# Altium project Hydrated_Buffs.PrjPcb
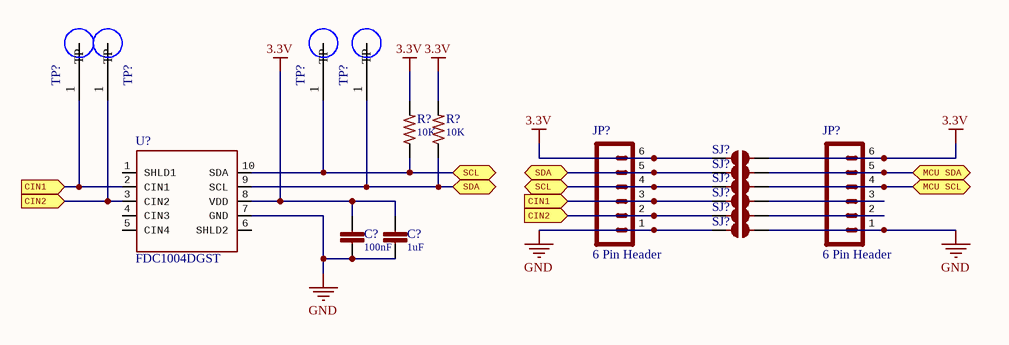
[diagram p0: FDC1004DGST.SchDoc]
3 sheets, 35 parts. Net scope: flat (ports and power ports of the same name join across sheets).
Sheets:
  FDC1004DGST.SchDoc
  Hydrated_Buffs.SchDoc
  Si7021.SchDoc

## Sheet FDC1004DGST.SchDoc
size A

### Parts
(Parts that share a designator on the sheet are numbered #1, #2 ... from top to bottom, then left to right.)
C?#1  value 100nF  (hidden comment: Cap100nF)
C?#2  value 1uF  (hidden comment: Cap1uF)
JP?#1  6 Pin Header
JP?#2  6 Pin Header
R?#1  value 10K  (hidden comment: Res10K)
R?#2  value 10K  (hidden comment: Res10K)
SJ?#1  Solder Jumper  (value not drawn)
SJ?#2  Solder Jumper  (value not drawn)
SJ?#3  Solder Jumper  (value not drawn)
SJ?#4  Solder Jumper  (value not drawn)
SJ?#5  Solder Jumper  (value not drawn)
SJ?#6  Solder Jumper  (value not drawn)
TP?#1  5019  [*TP380X203]  (value not drawn)
TP?#2  5019  [*TP380X203]  (value not drawn)
TP?#3  5019  [*TP380X203]  (value not drawn)
TP?#4  5019  [*TP380X203]  (value not drawn)
U?  FDC1004DGST  [FDC1004DGST]

### Ports
CIN1 (in), CIN2 (in), MCU SCL, MCU SDA, SCL, SDA

### Nets
3.3V: C?#1.1 C?#2.1 JP?#1.4 JP?#1.5 JP?#1.6 JP?#2.6 R?#1.1 R?#1.2 R?#2.1 R?#2.2 SJ?#1.1 SJ?#1.2 SJ?#2.1 SJ?#3.1 TP?#3.1(TP) TP?#4.1(TP) U?.8(VDD) U?.9(SCL) U?.10(SDA) ; port SCL, port SDA
GND: C?#1.2 C?#2.2 JP?#1.1 JP?#2.1 SJ?#6.1 SJ?#6.2 U?.7(GND)
NetJP?#1_2: JP?#1.2 SJ?#5.1 TP?#2.1(TP) U?.3(CIN2) ; port CIN2
NetJP?#1_3: JP?#1.3 SJ?#4.1 TP?#1.1(TP) U?.2(CIN1) ; port CIN1
NetJP?#2_2: JP?#2.2 SJ?#5.2
NetJP?#2_3: JP?#2.3 SJ?#4.2
NetJP?#2_4: JP?#2.4 SJ?#3.2 ; port MCU SCL
NetJP?#2_5: JP?#2.5 SJ?#2.2 ; port MCU SDA

Not connected (* = marked no-connect by the designer): U? 1(SHLD1) 4(CIN3) 5(CIN4) 6(SHLD2)

### Library data of the parts
TP?#1-TP?#4 = 5019: Phosphor Bronze Contact Miniature Silver Plated Surface Mount Test Points; MF: Keystone Electronics; Package: 2010 Keystone; Price: None; Availability: Unavailable; MP: 5019; SnapEDA_Link: https://www.snapeda.com/parts/5019/Keystone%20Electronics/view-part/?ref=snap; Value: *

## Sheet Hydrated_Buffs.SchDoc
size A
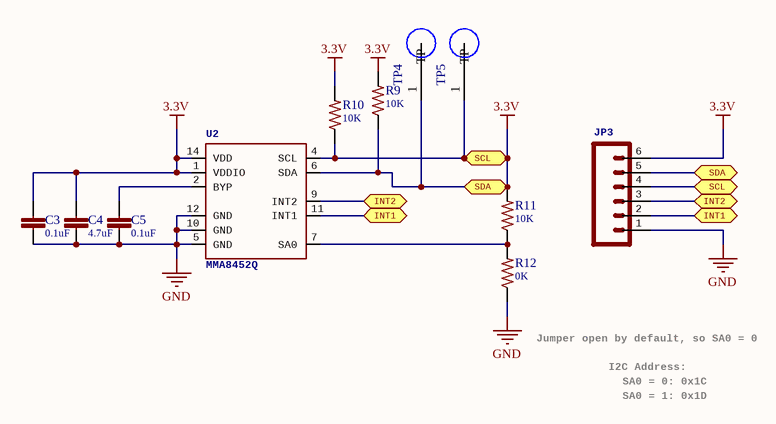
[diagram p1: Hydrated_Buffs.SchDoc]

### Parts
C3  value 0.1uF  (hidden comment: Cap0.1uF)
C4  value 4.7uF  (hidden comment: Cap4.7uF)
C5  value 0.1uF  (hidden comment: Cap0.1uF)
JP3  M06SIP  [1X06]  (value not drawn)
R9  value 10K  (hidden comment: Res10K)
R10  value 10K  (hidden comment: Res10K)
R11  value 10K  (hidden comment: Res10K)
R12  value 0K  (hidden comment: Res0K)
TP4  5019  [*TP380X203]  (value not drawn)
TP5  5019  [*TP380X203]  (value not drawn)
U2  MMA8452Q  [QFN-16_0.5MM]

### Ports
INT1, INT2, SCL, SDA

### Nets
3.3V: C3.1 C4.1 JP3.4 JP3.5 JP3.6 R9.1 R9.2 R10.1 R10.2 R11.2 TP4.1(TP) TP5.1(TP) U2.1(VDDIO) U2.4(SCL) U2.6(SDA) U2.14(VDD) ; port SCL, port SDA
GND: C3.2 C4.2 C5.2 JP3.1 R12.1 U2.5(GND) U2.10(GND) U2.12(GND)
NetC5_1: C5.1 U2.2(BYP)
NetJP3_2: JP3.2 U2.11(INT1) ; port INT1
NetJP3_3: JP3.3 U2.9(INT2) ; port INT2
NetR11_1: R11.1 R12.2 U2.7(SA0)

### Notes on the sheet
- (near R12) Jumper open by default, so SA0 = 0
- I2C Address:
- SA0 = 0: 0x1C
- SA0 = 1: 0x1D

### Library data of the parts
JP3 = M06SIP: Header 6Standard 6-pin 0.1" header. Use with straight break away headers (SKU : PRT-00116), right angle break away headers (PRT-00553), swiss pins (PRT-00743), machine pins (PRT-00117), and female headers (PRT-00115). Molex polarized connector foot print use with SKU : PRT-08094 with associated crimp pins and housings. NOTES ON THE VARIANTS LOCK and LOCK_LONGPADS... This footprint was designed to help hold the alignment of a through-hole component (i.e.  6-pin header) while soldering it into place. You may notice that each hole has been shifted either up or down by 0.005 of an inch from it's more standard position (which is a perfectly straight line). This slight alteration caused the pins (the squares in the middle) to touch the edges of the holes.  Because they are alternating, it causes a "brace" to hold the component in place.  0.005 has proven to be the perfect amount of "off-center" position when using our standard breakaway headers. Although looks a little odd when you look at the bare footprint, once you have a header in there, the alteration is very hard to notice.  Also, if you push a header all the way into place, it is covered up entirely on the bottom side.  This idea of altering the position of holes to aid alignment will be further integrated into the Sparkfun Library for other footprints.  It can help hold any component with 3 or more connection pins.
TP4 TP5 = 5019: as TP?#1 on sheet FDC1004DGST; Package: 2010 Keystone; Price: None; Availability: Unavailable; MP: 5019; SnapEDA_Link: https://www.snapeda.com/parts/5019/Keystone%20Electronics/view-part/?ref=snap; Value: *
U2 = MMA8452Q: MMA8452Q 3-Axis, 12/8-bit Digital Accelerometer  Supply Voltage: 1.6-3.6V  Range: +/- 2g, 4g, 8g  Interface: I2C, 12-bit and 8-bit  ODR: 1.56 Hz - 800 Hz  Package: QFN-16      http://cache.freescale.com/files/sensors/doc/data_sheet/MMA8452Q.pdf

## Sheet Si7021.SchDoc
size A
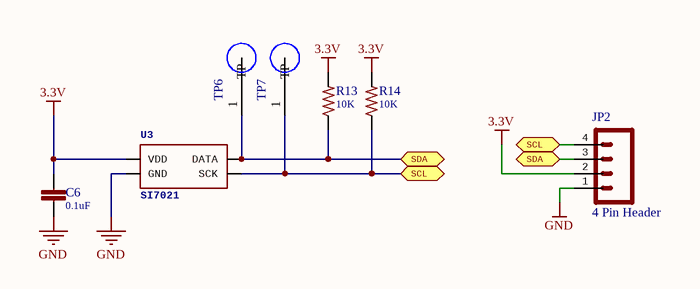
[diagram p2: Si7021.SchDoc]

### Parts
C6  value 0.1uF  (hidden comment: Cap0.1uF)
JP2  4 Pin Header
R13  value 10K  (hidden comment: Res10K)
R14  value 10K  (hidden comment: Res10K)
TP6  5019  [*TP380X203]  (value not drawn)
TP7  5019  [*TP380X203]  (value not drawn)
U3  SI7021  [SI7021]

### Ports
SCL, SDA

### Nets
3.3V: C6.1 JP2.2 JP2.3 JP2.4 R13.1 R13.2 R14.1 R14.2 TP6.1(TP) TP7.1(TP) U3.DATA U3.SCK U3.VDD ; port SDA, port SCL
GND: C6.2 JP2.1 U3.GND

### Library data of the parts
TP6 TP7 = 5019: as TP?#1 on sheet FDC1004DGST; Package: 2010 Keystone; Price: None; Availability: Unavailable; MP: 5019; SnapEDA_Link: https://www.snapeda.com/parts/5019/Keystone%20Electronics/view-part/?ref=snap; Value: *
U3 = SI7021: The Si7021 is an I2C Humidity and Temperature Sensor; PROD_ID: IC-13093

## Nets that join several sheets
3.3V: FDC1004DGST (19 pins), Hydrated_Buffs (16 pins), Si7021 (13 pins)
GND: FDC1004DGST (7 pins), Hydrated_Buffs (8 pins), Si7021 (C6.2 JP2.1 U3.GND)